# Altium schematic sheet PLC dual power input.SchDoc: PLC power supply
size 127 x 101 mm; SheetNumber: 4; SheetTotal: 4
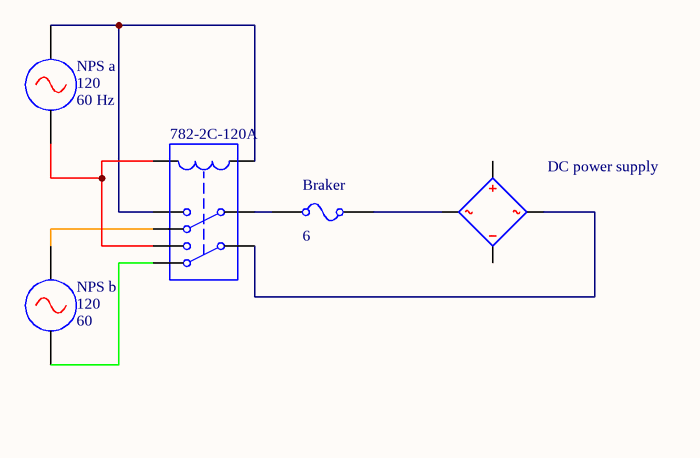
[diagram p0: PLC dual power input.SchDoc]

## Parts
782-2C-120A  Double-Pole, Double-Throw Relay  (value not drawn)
Braker  CURRENT: 6  (hidden comment: Fuse)
DC_power_supply  Four Diodes Bridge Rectifier  (value not drawn)
NPS_a  V: 120  Freq: 60 Hz  (hidden comment: AC Voltage Source)
NPS_b  Voltage: 120  Freq: 60  (hidden comment: AC Voltage Source)

## Nets
Net782-2C-120A_1: 782-2C-120A.1 DC_power_supply.2
Net782-2C-120A_2: 782-2C-120A.2 782-2C-120A.8 NPS_a.2
Net782-2C-120A_3: 782-2C-120A.3 NPS_b.2
Net782-2C-120A_4: 782-2C-120A.4 Braker.1
Net782-2C-120A_5: 782-2C-120A.5 782-2C-120A.7 NPS_a.1
Net782-2C-120A_6: 782-2C-120A.6 NPS_b.1
NetBraker_2: Braker.2 DC_power_supply.1

Not connected (* = marked no-connect by the designer): DC_power_supply 3(POS) 4(NEG)

## Library data of the parts
782-2C-120A = DPDT Relay: L_C: 1u; R_C: 100; RON: 1; ROFF: 1e12; ION: 1m; IOFF: 0; SimulationGenericComponent: True
Braker = Fuse: RESISTANCE: 1m; SimulationGenericComponent: True
DC_power_supply = Bridge Rectifier: area: 1; temp: 27; dtemp: 0; EG: 1.11; FC: 0.5; IBV: 100p; IS: 10f; NTUN: 30; XTITUN: 3; MJSW: 0.33; BV_MAX: 1e99; SimulationGenericComponent: True; pj: 1; AF: 1; BV: 0; CJO: 0; IBVL: 0; IKF: 0; IKR: 0; JSW: 0; JTUN: 0; JTUNSW: 0; KEG: 1; CJP: 0; FCS: 0.5; PHP: 1; ISR: 0; KF: 0; N: 1; NBV: 1; NBVL: 1; NR: 1; NS: 1; RS: 0; TBV1: 0; TBV2: 0; TIKF: 0; TRS1: 0; TRS2: 0; TT: 0; VJ: 1; XTI: 3; TNOM: 27; TM1: 0; TM2: 0; TTT1: 0; TTT2: 0; TLEV: 0; TLEVC: 0; CTA: 0; CTP: 0; TCV: 0; TVJ: 0; TPHP: 0; FV_MAX: 1e99; M: 0.5
NPS_a NPS_b = AC Voltage Source: SimulationGenericComponent: True; DC: 0; Phase: 0; Rser: 0; Cpar: 0